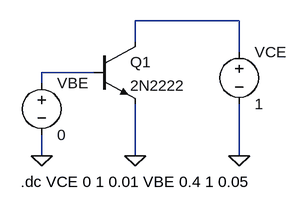
[diagram p0: schematic BJT_output.asc]
BJT_output.asc, the LTspice schematic file:
Version 4
SHEET 1 880 680
WIRE 320 80 160 80
WIRE 160 112 160 80
WIRE 320 128 320 80
WIRE 96 160 16 160
WIRE 16 176 16 160
WIRE 16 288 16 256
WIRE 160 288 160 208
WIRE 320 288 320 208
FLAG 16 288 0
FLAG 160 288 0
FLAG 320 288 0
SYMBOL npn 96 112 R0
SYMATTR InstName Q1
SYMATTR Value 2N2222
SYMBOL voltage 16 160 R0
WINDOW 123 0 0 Left 0
WINDOW 39 0 0 Left 0
SYMATTR InstName VBE
SYMATTR Value 0
SYMBOL voltage 320 112 R0
WINDOW 123 0 0 Left 0
WINDOW 39 0 0 Left 0
SYMATTR InstName VCE
SYMATTR Value 1
TEXT -16 328 Left 2 !.dc VCE 0 1 0.01 VBE 0.4 1 0.05

The netlist it stands for:
* BJT_output.asc
Q1 N001 N002 0 0 2N2222
VBE N002 0 0
VCE N001 0 1
.model NPN NPN
.model PNP PNP
.lib standard.bjt
.dc VCE 0 1 0.01 VBE 0.4 1 0.05
.backanno
.end